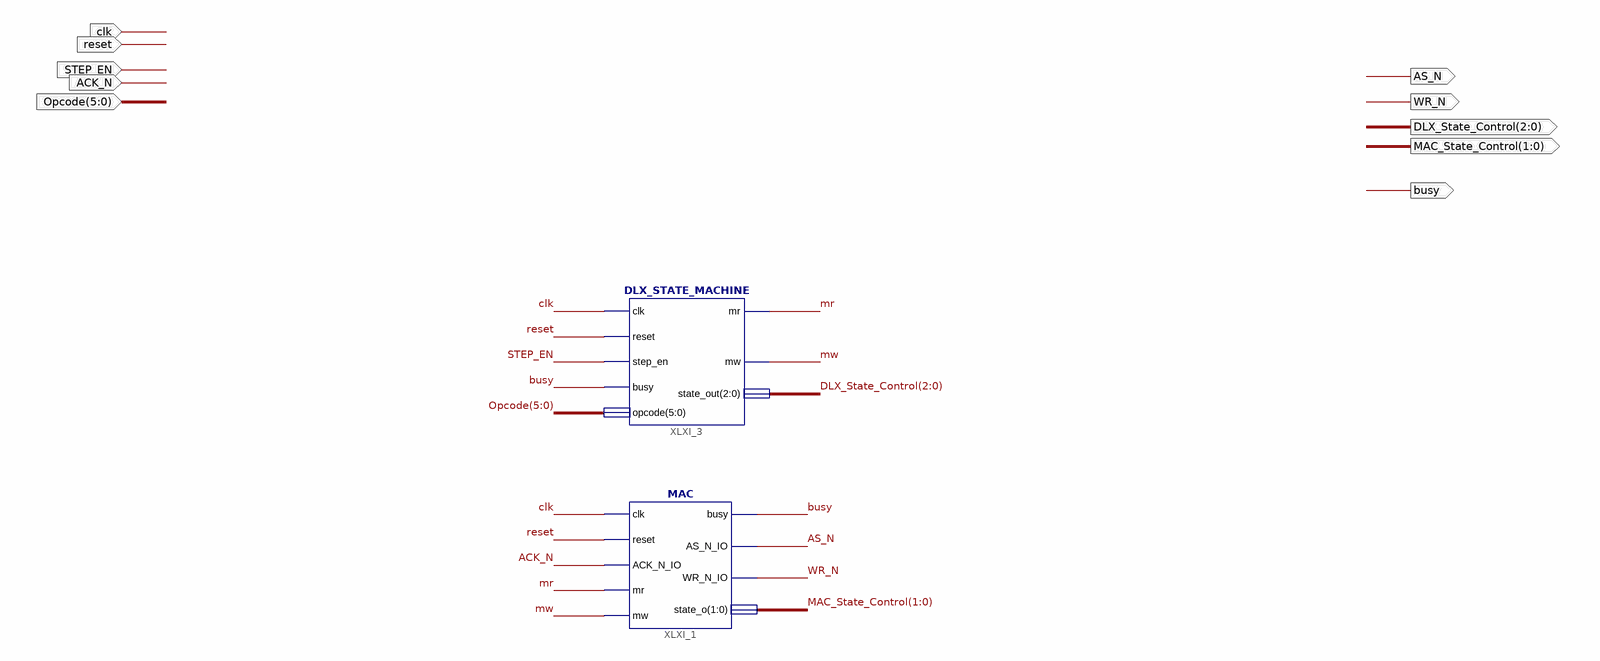
[diagram p0: schematic sheet 1]
// Xilinx ISE schematic DLX_Control_Module.sch (spartan6) as structural Verilog: 2 symbols, 10 ports
module DLX_Control_Module (
  input  clk,
  input  reset,
  input  ACK_N,
  input  STEP_EN,
  input  [5:0] Opcode,
  output busy,
  output AS_N,
  output WR_N,
  output [2:0] DLX_State_Control,
  output [1:0] MAC_State_Control
);

  wire mr, mw;

  MAC XLXI_1 (
    .clk(clk), .reset(reset), .ACK_N_IO(ACK_N), .mr(mr), .mw(mw), .busy(busy), .AS_N_IO(AS_N),
    .WR_N_IO(WR_N), .state_o(MAC_State_Control));
  DLX_STATE_MACHINE XLXI_3 (
    .clk(clk), .reset(reset), .step_en(STEP_EN), .busy(busy), .opcode(Opcode), .mr(mr), .mw(mw),
    .state_out(DLX_State_Control));
endmodule
